# EAGLE design GoL 1.3 (EAGLE 7.2.0)
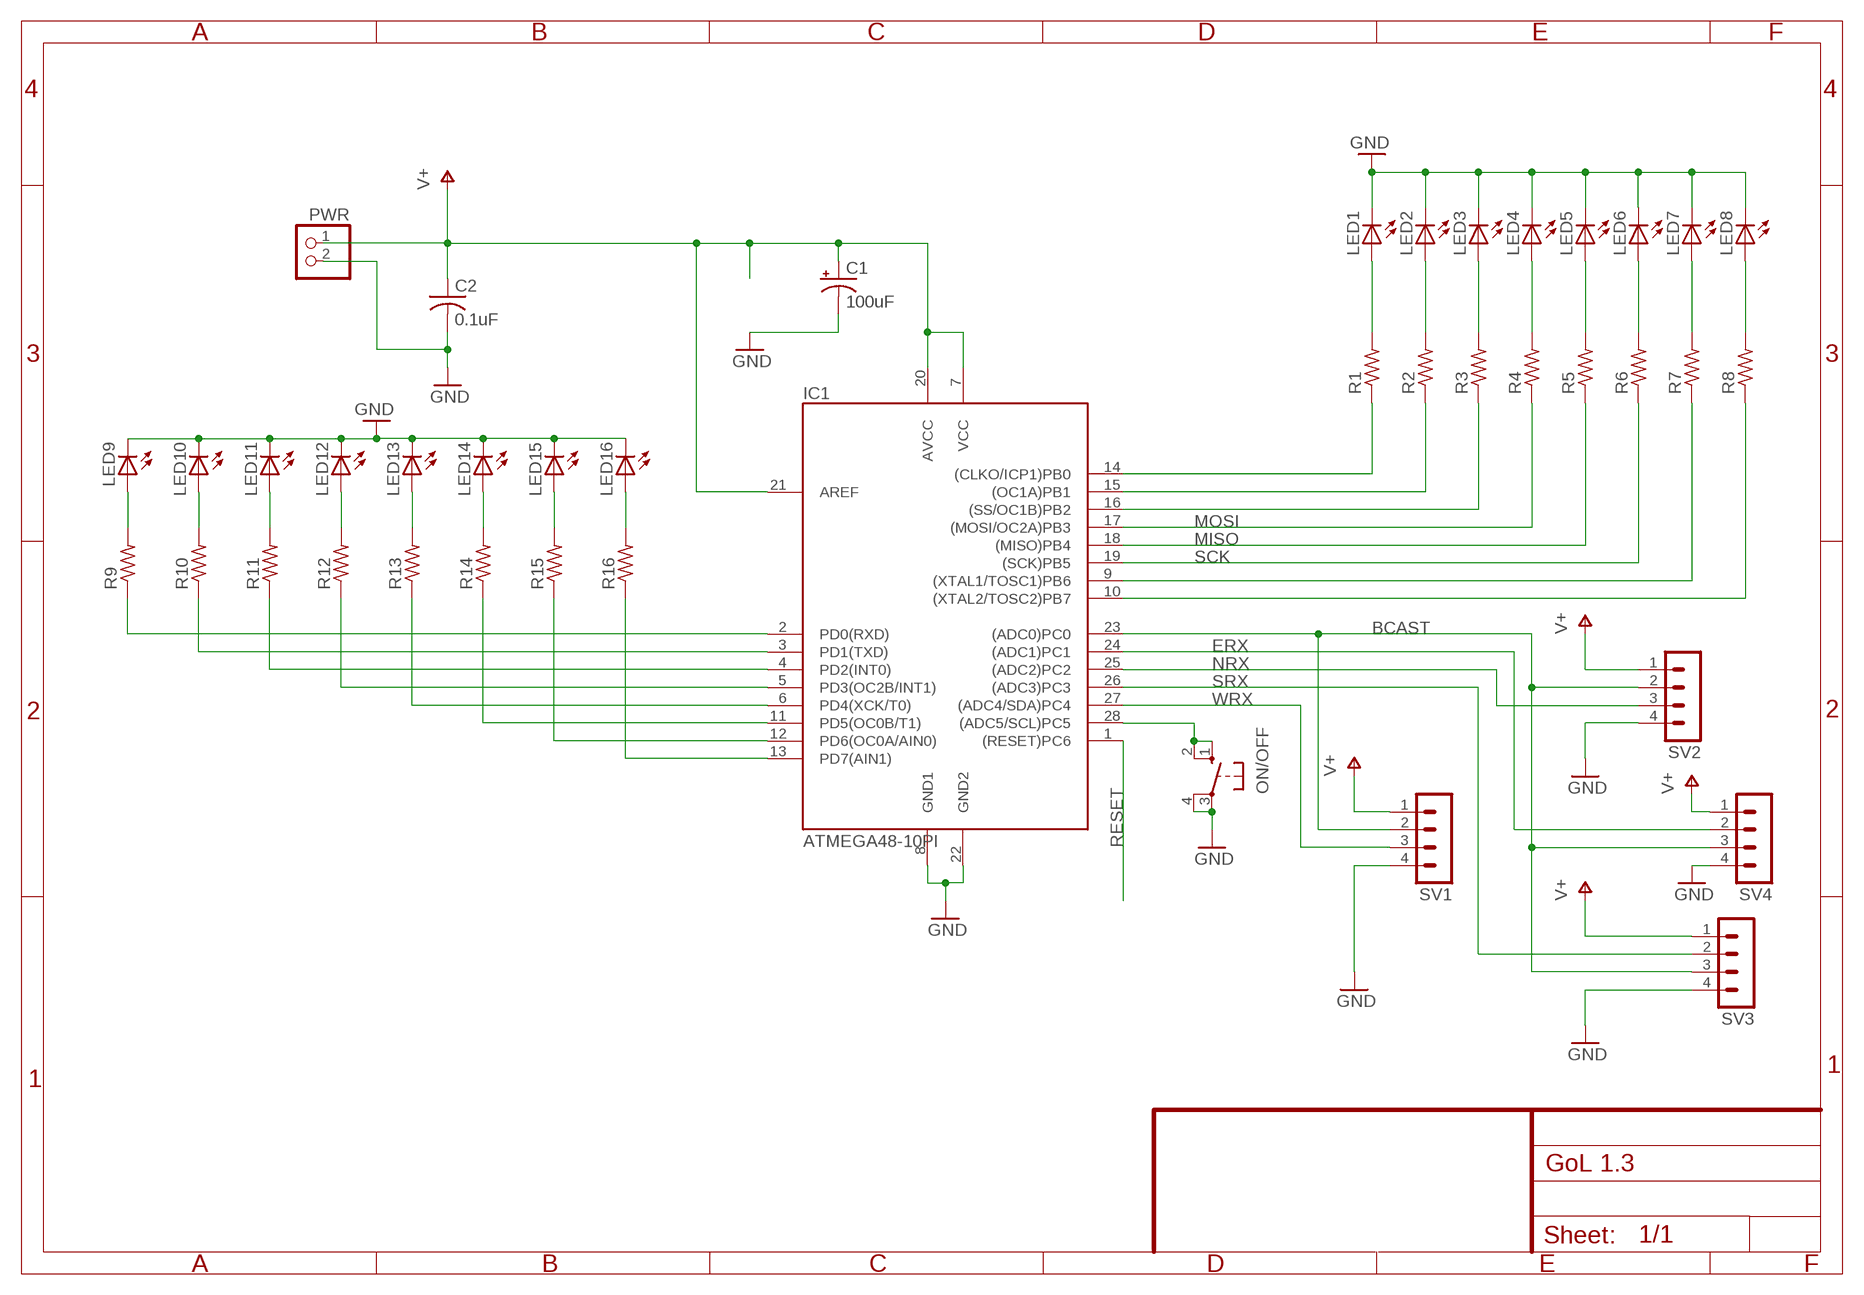
[diagram p0: schematic, sheet 1]

## Parts
C1  100uF  CPOL-USE2.5-6  [E2,5-6]
C2  0.1uF  C-US025-025X050  [C025-025X050]
IC1  ATMEGA48-10PI  [DIL28-3]
LED1  LED5MMEZ  [LED5MM-EZ]
LED2  LED5MMEZ  [LED5MM-EZ]
LED3  LED5MMEZ  [LED5MM-EZ]
LED4  LED5MMEZ  [LED5MM-EZ]
LED5  LED5MMEZ  [LED5MM-EZ]
LED6  LED5MMEZ  [LED5MM-EZ]
LED7  LED5MMEZ  [LED5MM-EZ]
LED8  LED5MMEZ  [LED5MM-EZ]
LED9  LED5MMEZ  [LED5MM-EZ]
LED10  LED5MMEZ  [LED5MM-EZ]
LED11  LED5MMEZ  [LED5MM-EZ]
LED12  LED5MMEZ  [LED5MM-EZ]
LED13  LED5MMEZ  [LED5MM-EZ]
LED14  LED5MMEZ  [LED5MM-EZ]
LED15  LED5MMEZ  [LED5MM-EZ]
LED16  LED5MMEZ  [LED5MM-EZ]
ON/OFF  10-XX  [B3F-10XX]
PWR  PINHD-1X2  [1X02]
R1  R-US_0207/10  [0207/10]
R2  R-US_0207/10  [0207/10]
R3  R-US_0207/10  [0207/10]
R4  R-US_0207/10  [0207/10]
R5  R-US_0207/10  [0207/10]
R6  R-US_0207/10  [0207/10]
R7  R-US_0207/10  [0207/10]
R8  R-US_0207/10  [0207/10]
R9  R-US_0207/10  [0207/10]
R10  R-US_0207/10  [0207/10]
R11  R-US_0207/10  [0207/10]
R12  R-US_0207/10  [0207/10]
R13  R-US_0207/10  [0207/10]
R14  R-US_0207/10  [0207/10]
R15  R-US_0207/10  [0207/10]
R16  R-US_0207/10  [0207/10]
SV1  MA04-1  [MA04-1]
SV2  MA04-1  [MA04-1]
SV3  MA04-1  [MA04-1]
SV4  MA04-1  [MA04-1]

## Nets
BCAST: IC1.23((ADC0)PC0) SV1.2 SV2.2 SV3.3 SV4.3
ERX: IC1.24((ADC1)PC1) SV4.2
GND: C1.- C2.2 IC1.8(GND1) IC1.22(GND2) LED1.K(C) LED2.K(C) LED3.K(C) LED4.K(C) LED5.K(C) LED6.K(C) LED7.K(C) LED8.K(C) LED9.K(C) LED10.K(C) LED11.K(C) LED12.K(C) LED13.K(C) LED14.K(C) LED15.K(C) LED16.K(C) ON/OFF.3(P) ON/OFF.4(P1) PWR.2 SV1.4 SV2.4 SV3.4 SV4.4
MISO: IC1.18((MISO)PB4) R5.1
MOSI: IC1.17((MOSI/OC2A)PB3) R4.1
N$1: LED1.A R1.2
N$2: LED2.A R2.2
N$3: LED3.A R3.2
N$4: LED4.A R4.2
N$5: LED5.A R5.2
N$6: LED6.A R6.2
N$7: LED7.A R7.2
N$8: LED8.A R8.2
N$9: LED9.A R9.2
N$10: LED10.A R10.2
N$11: LED11.A R11.2
N$12: LED12.A R12.2
N$13: LED13.A R13.2
N$14: LED14.A R14.2
N$15: LED15.A R15.2
N$16: LED16.A R16.2
N$17: IC1.13(PD7(AIN1)) R16.1
N$18: IC1.12(PD6(OC0A/AIN0)) R15.1
N$19: IC1.11(PD5(OC0B/T1)) R14.1
N$20: IC1.6(PD4(XCK/T0)) R13.1
N$21: IC1.5(PD3(OC2B/INT1)) R12.1
N$22: IC1.4(PD2(INT0)) R11.1
N$23: IC1.3(PD1(TXD)) R10.1
N$24: IC1.2(PD0(RXD)) R9.1
N$25: IC1.28((ADC5/SCL)PC5) ON/OFF.1(S) ON/OFF.2(S1)
N$26: IC1.14((CLKO/ICP1)PB0) R1.1
N$27: IC1.15((OC1A)PB1) R2.1
N$28: IC1.16((SS/OC1B)PB2) R3.1
N$32: IC1.9((XTAL1/TOSC1)PB6) R7.1
N$33: IC1.10((XTAL2/TOSC2)PB7) R8.1
NRX: IC1.25((ADC2)PC2) SV2.3
RESET: IC1.1((RESET)PC6)
SCK: IC1.19((SCK)PB5) R6.1
SRX: IC1.26((ADC3)PC3) SV3.2
V+: C1.+ C2.1 IC1.7(VCC) IC1.20(AVCC) IC1.21(AREF) PWR.1 SV1.1 SV2.1 SV3.1 SV4.1
WRX: IC1.27((ADC4/SDA)PC4) SV1.3

## Library data of the parts
C1 = rcl-ez:CPOL-US: POLARIZED CAPACITOR, American symbol
C2 = rcl-ez:C-US: CAPACITOR, American symbol
IC1 = atmel-2005:ATMEGA*PI: MICROCONTROLLER 8KB Flash 10-bit ADC Six PWM Channels
LED1-LED16 = led:LED: LED OSRAM: - CHIPLED LG R971, LG N971, LY N971, LG Q971, LY Q971, LO R971, LY R971 LH N974, LH R974 LS Q976, LO Q976, LY Q976 LO Q996 - Hyper CHIPLED LW Q18S LB Q993, LB Q99A, LB R99A - SideLED LS A670, LO A670, LY A670, LG A670, LP A670 LB A673, LV A673, LT A673, LW A673 LH A674 LY A675 LS A676, LA A676, LO A676, LY A676, LW A676 LS A679, LY A679, LG A679 - Hyper Micro SIDELED® LS Y876, LA Y876, LO Y876, LY Y876 LT Y87S - SmartLED LW L88C, LW L88S LB L89C, LB L89S, LG L890 LS L89K, LO L89K, LY L89K LS L896, LA L896, LO L896, LY L896 - TOPLED LS T670, LO T670, LY T670, LG T670, LP T670 LSG T670, LSP T670, LSY T670, LOP T670, LYG T670 LG T671, LOG T671, LSG T671 LB T673, LV T673, LT T673, LW T673 LH T674 LS T676, LA T676, LO T676, LY T676, LB T676, LH T676, LSB T676, LW T676 LB T67C, LV T67C, LT T67C, LS T67K, LO T67K, LY T67K, LW E67C LS E67B, LA E67B, LO E67B, LY E67B, LB E67C, LV E67C, LT E67C LW T67C LS T679, LY T679, LG T679 LS T770, LO T770, LY T770, LG T770, LP T770 LB T773, LV T773, LT T773, LW T773 LH T774 LS E675, LA E675, LY E675, LS T675 LS T776, LA T776, LO T776, LY T776, LB T776 LHGB T686 LT T68C, LB T68C - Hyper Mini TOPLED® LB M676 - Mini TOPLED Santana® LG M470 LS M47K, LO M47K, LY M47K Source: http://www.osram.convergy.de/
ON/OFF = switch-omron:10-XX: OMRON SWITCH
PWR = pinhead:PINHD-1X2: PIN HEADER
R1-R16 = rcl-ez:R-US_: RESISTOR, American symbol
SV1-SV4 = con-lstb:MA04-1: PIN HEADER; OC_FARNELL: unknown; OC_NEWARK: unknown

## Net classes
1 power: width 1.27 mm, drill 0.711 mm, clearance 0.406 mm

## Board
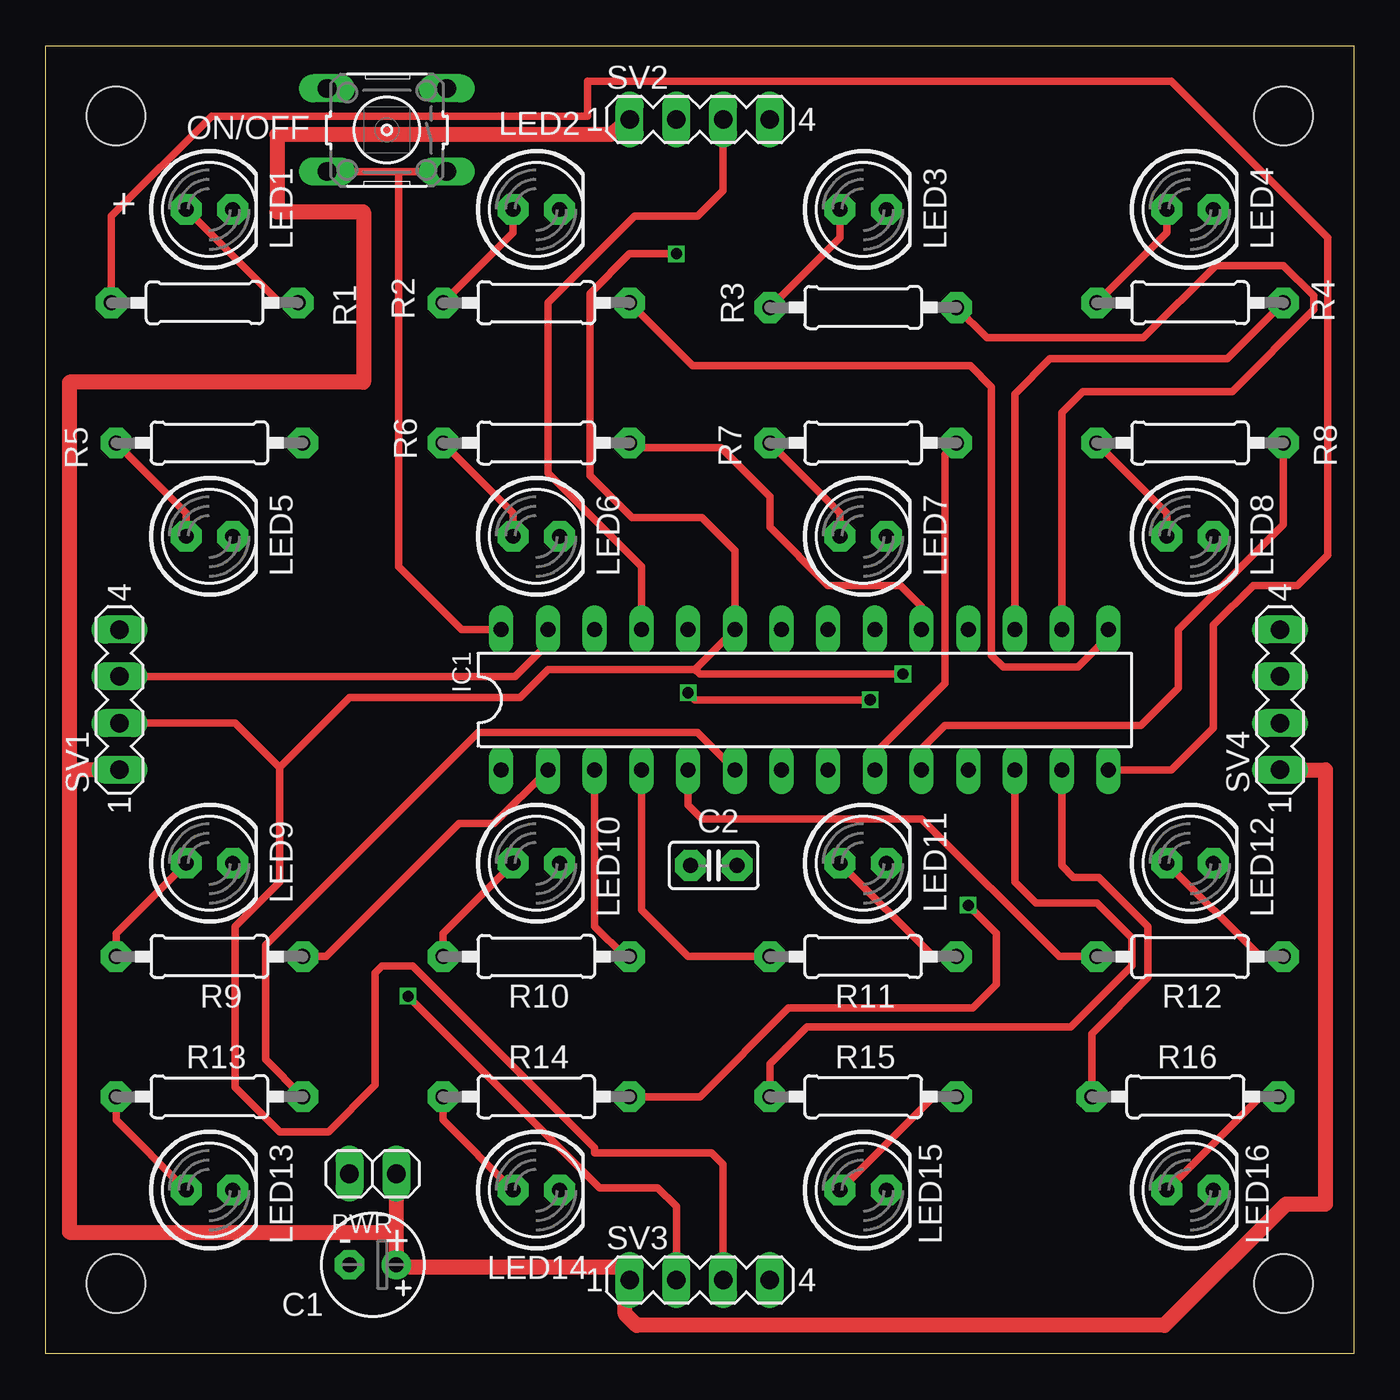
[diagram p1: board, top side]
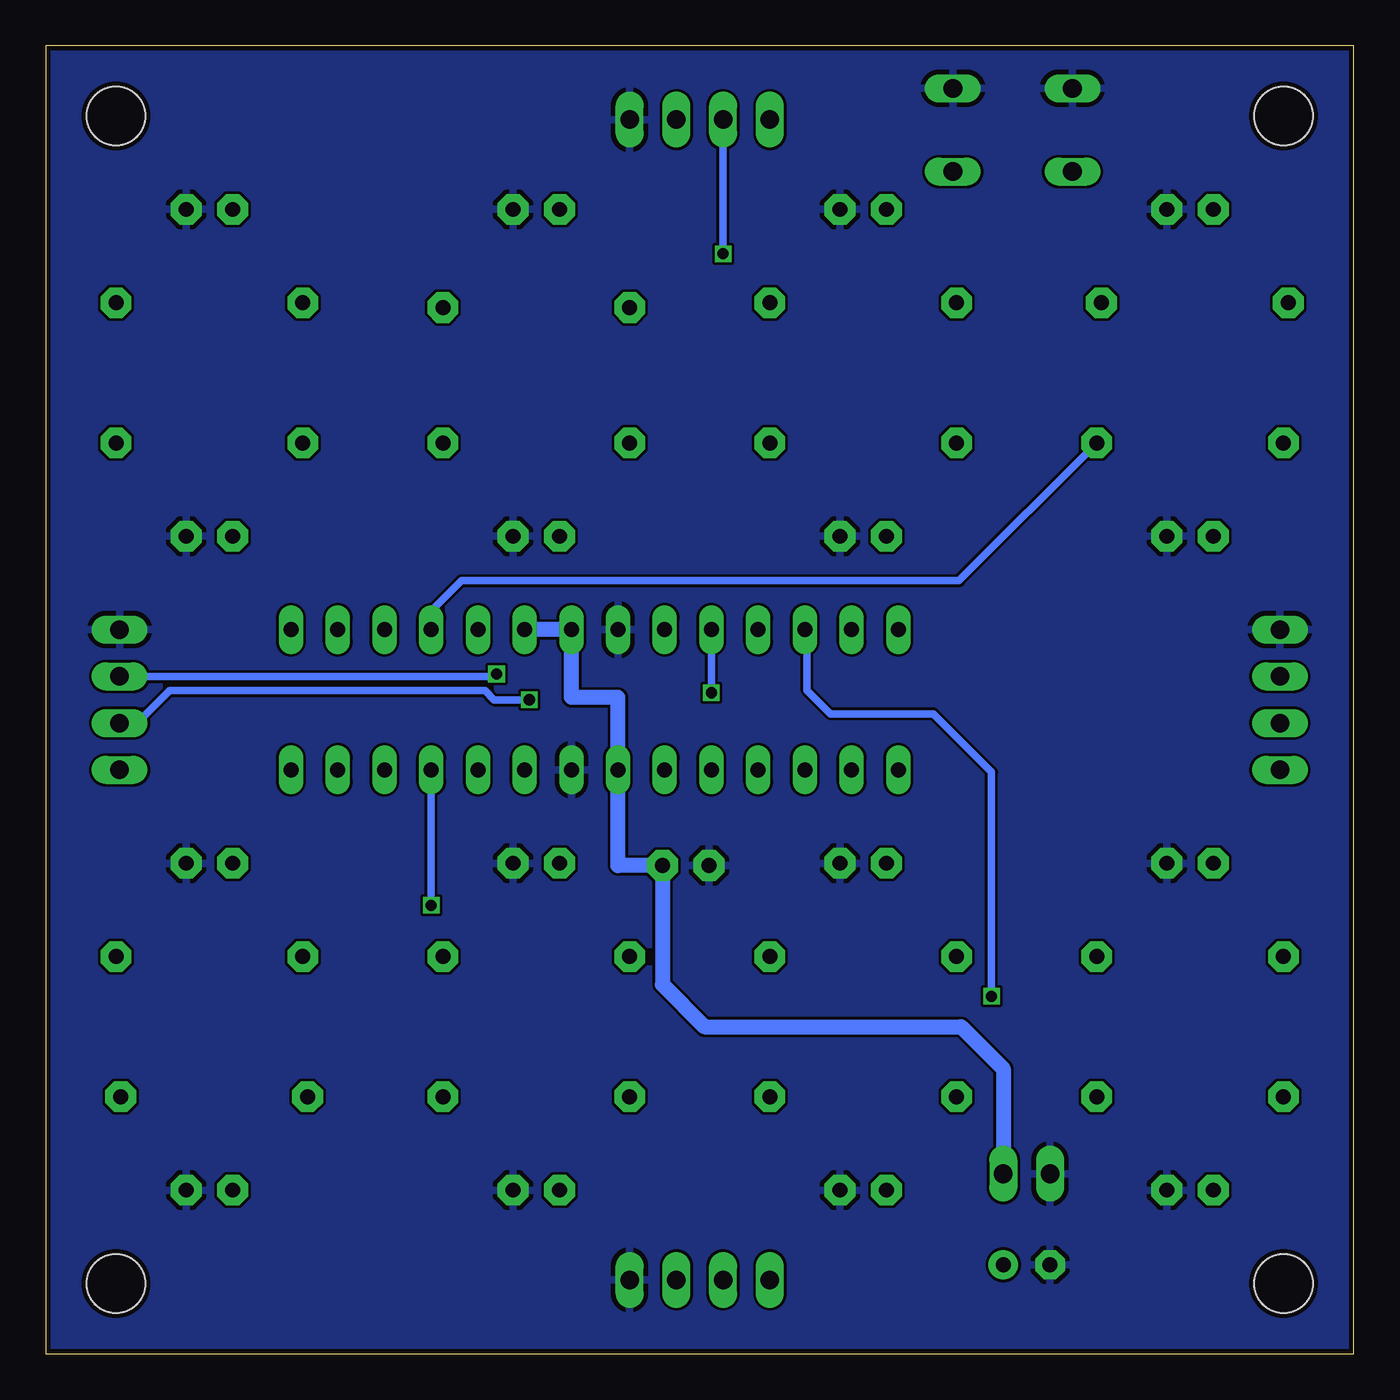
[diagram p2: board, bottom side, seen from below]

Size 71.12 x 71.12 mm. Coordinates in mm from the lower left corner, seen from the top.
Outline: 0,0 0,71.12 71.12,71.12 71.12,0 0,0
Copper layers (1*16): Top 0.035mm / dielectric 1.5mm / Bottom 0.035mm
Design rules "SeeedStudio_2layer_DRU_no_angle_20140221": minimum track width 6mil, minimum drill 12mil, track to track 6mil, track to pad 6mil, pad to pad 6mil, via to via 6mil, smd to smd 0mil, copper to edge 10mil, drill to drill 10mil, minimum pad ring 10mil, minimum via ring 6mil, stop-mask expansion 2mil, vias tented up to drill 100mil, thermal gap 10mil
Holes 3.2 mm at 3.81,67.31 67.31,67.31 67.31,3.81 3.81,3.81

### Footprints (pad centres in the part's own frame; a part is rotated, then mirrored left to right if it is on the bottom)
E2,5-6 = drill 0.813 pad 1.6: + -1.27,0 | drill 0.813 pad 1.6 octagon: - 1.27,0
C025-025X050 = drill 0.813 pad 1.676 octagon: 1 -1.27,0; 2 1.27,0
DIL28-3 = drill 0.813 long: 1 -16.51,-3.81; 2 -13.97,-3.81; 3 -11.43,-3.81; 4 -8.89,-3.81; 5 -6.35,-3.81; 6 -3.81,-3.81; 7 -1.27,-3.81; 8 1.27,-3.81; 9 3.81,-3.81; 10 6.35,-3.81; 11 8.89,-3.81; 12 11.43,-3.81; 13 13.97,-3.81; 14 16.51,-3.81; 15 16.51,3.81; 16 13.97,3.81; 17 11.43,3.81; 18 8.89,3.81; 19 6.35,3.81; 20 3.81,3.81; 21 1.27,3.81; 22 -1.27,3.81; 23 -3.81,3.81; 24 -6.35,3.81; 25 -8.89,3.81; 26 -11.43,3.81; 27 -13.97,3.81; 28 -16.51,3.81
LED5MM-EZ = drill 0.813 pad 1.676 octagon: A -1.27,0; K 1.27,0
B3F-10XX = drill 1.016 long: 1 -3.251,2.261; 2 3.251,2.261; 3 -3.251,-2.261; 4 3.251,-2.261
1X02 = drill 1.016 long: 1 -1.27,0; 2 1.27,0
0207/10 = drill 0.813 pad 1.676 octagon: 1 -5.08,0; 2 5.08,0
MA04-1 = drill 1.016 long: 1 -3.81,0; 2 -1.27,0; 3 1.27,0; 4 3.81,0

### Placement (x,y rotation side)
C1  17.78,4.83 180 top
C2  36.32,26.54 180 top
IC1  41.27,35.56 0 top
LED1  8.89,62.23 0 top
LED2  26.67,62.23 0 top
LED3  44.45,62.23 0 top
LED4  62.23,62.23 0 top
LED5  8.89,44.45 0 top
LED6  26.67,44.45 0 top
LED7  44.45,44.45 0 top
LED8  62.23,44.45 0 top
LED9  8.89,26.67 0 top
LED10  26.67,26.67 0 top
LED11  44.45,26.67 0 top
LED12  62.23,26.67 0 top
LED13  8.89,8.89 0 top
LED14  26.67,8.89 0 top
LED15  44.45,8.89 0 top
LED16  62.23,8.89 0 top
ON/OFF  18.54,66.55 180 top
PWR  17.78,9.78 180 top
R1  8.64,57.15 0 top
R2  26.67,57.15 180 top
R3  44.45,56.9 180 top
R4  62.23,57.15 180 top
R5  8.89,49.53 180 top
R6  26.67,49.53 180 top
R7  44.45,49.53 180 top
R8  62.23,49.53 180 top
R9  8.89,21.59 180 top
R10  26.67,21.59 180 top
R11  44.45,21.59 0 top
R12  62.23,21.59 0 top
R13  8.89,13.97 180 top
R14  26.67,13.97 180 top
R15  44.45,13.97 0 top
R16  61.98,13.97 0 top
SV1  4,35.56 90 top
SV2  35.56,67.12 0 top
SV3  35.56,4 0 top
SV4  67.12,35.56 90 top

### Tracks (layer width: path | path; a pad name or v marks a point on that pad's centre or on a via)
BCAST  (via drill 0.6)
  Top 0.406: 35.31,37.21 27.3,37.21 25.78,35.69 16.51,35.69 12.7,31.88 | 35.31,37.21 IC1.23 37.47,43.69 35.69,45.47 31.88,45.47 29.59,47.75 29.59,57.66 31.75,59.82 v34.29,59.82 | v46.61,36.96 35.56,36.96 35.31,37.21 | SV3.3 36.83,10.29 36.2,10.92 29.84,10.92 29.84,11.18 19.94,21.08 18.29,21.08 17.91,20.7 17.91,14.61 15.37,12.06 12.7,12.06 10.29,14.48 10.29,23.24 12.7,25.65 12.7,31.88 | SV1.2 10.29,34.29 12.7,31.88
  Bottom 0.406: SV4.3 46.74,36.83 v46.61,36.96 | v34.29,59.82 SV2.2
ERX  (via drill 0.6)
  Top 0.406: v44.83,35.56 35.31,35.56 v34.92,35.94
  Bottom 0.406: SV4.2 66.17,34.29 64.39,36.07 47.24,36.07 46.74,35.56 v44.83,35.56 | v34.92,35.94 IC1.24
GND
  pour Bottom: 0,0 0,71.12 71.12,71.12 71.12,0
MISO
  Bottom 0.406: IC1.18 50.16,40.39 48.51,42.04 21.46,42.04 R5.1
MOSI
  Top 0.406: IC1.17 52.7,52.2 54.61,54.1 64.26,54.1 R4.1
N$1
  Top 0.406: R1.2 12.7,57.15 LED1.A
N$2
  Top 0.406: LED2.A 25.4,60.96 R2.2
N$3
  Top 0.406: LED3.A 43.18,60.71 R3.2
N$4
  Top 0.406: LED4.A 60.96,60.96 R4.2
N$5
  Top 0.406: LED5.A 7.62,45.72 R5.2
N$6
  Top 0.406: LED6.A 25.4,45.72 R6.2
N$7
  Top 0.406: LED7.A 43.18,45.72 R7.2
N$8
  Top 0.406: LED8.A 60.96,45.72 R8.2
N$9
  Top 0.406: R9.2 3.81,22.86 LED9.A
N$10
  Top 0.406: R10.2 21.59,22.86 LED10.A
N$11
  Top 0.406: R11.2 48.26,21.59 LED11.A
N$12
  Top 0.406: R12.2 66.04,21.59 LED12.A
N$13
  Top 0.406: R13.2 3.81,12.7 LED13.A
N$14
  Top 0.406: R14.2 21.59,12.7 LED14.A
N$15
  Top 0.406: R15.2 48.26,13.97 LED15.A
N$16
  Top 0.406: R16.2 66.04,13.97 LED16.A
N$17
  Top 0.406: R16.1 56.9,17.4 59.94,20.45 59.94,23.24 57.28,25.91 55.88,25.91 55.24,26.54 IC1.13
N$18
  Top 0.406: R15.1 39.37,15.75 41.4,17.78 55.75,17.78 59.05,21.08 59.05,22.61 57.15,24.51 53.85,24.51 52.7,25.65 IC1.12
N$19  (via drill 0.6)
  Top 0.406: R14.1 35.56,13.97 40.39,18.8 50.42,18.8 51.69,20.07 51.69,22.86 v50.16,24.38
  Bottom 0.406: v50.16,24.38 IC1.11
N$20
  Top 0.406: R13.1 11.94,16 11.94,22.23 23.5,33.78 35.43,33.78 IC1.6
N$21
  Top 0.406: R12.1 55.12,21.59 47.62,29.08 35.69,29.08 34.92,29.84 IC1.5
N$22
  Top 0.406: R11.1 34.92,21.59 32.38,24.13 IC1.4
N$23
  Top 0.406: R10.1 31.5,21.59 29.84,23.24 IC1.3
N$24
  Top 0.406: R9.1 15.24,21.59 22.48,28.83 24.38,28.83 IC1.2
N$25
  Top 0.406: ON/OFF.1 19.18,64.29 | 19.18,64.29 ON/OFF.2 | IC1.28 22.61,39.37 19.18,42.8 19.18,64.29
N$26
  Top 0.406: R1.1 3.56,61.85 9.02,67.31 29.46,67.31 29.46,69.22 61.21,69.22 69.72,60.71 69.72,43.43 68.07,41.78 65.66,41.78 63.5,39.62 63.5,34.04 61.21,31.75 IC1.14
N$27
  Top 0.406: IC1.15 57.78,38.99 56.13,37.34 52.07,37.34 51.44,37.97 51.44,52.58 50.29,53.72 35.18,53.72 R2.1
N$28
  Top 0.406: IC1.16 55.24,51.18 56.39,52.32 64.52,52.32 68.96,56.77 68.96,57.53 67.31,59.18 63.63,59.18 59.69,55.24 51.18,55.24 R3.1
N$32
  Top 0.406: IC1.9 45.09,32.64 48.9,36.45 48.9,48.9 R7.1
N$33
  Top 0.406: R8.1 67.31,45.09 61.59,39.37 61.59,36.2 59.56,34.16 48.9,34.16 47.62,32.89 IC1.10
NRX
  Top 0.406: IC1.25 32.38,42.8 27.3,47.88 27.3,57.15 32,61.85 35.43,61.85 36.83,63.25 SV2.3
SCK
  Top 0.406: IC1.19 47.62,40.64 46.48,41.78 42.55,41.78 39.37,44.96 39.37,46.61 36.7,49.28 32,49.28 R6.1
SRX  (via drill 0.6)
  Top 0.406: SV3.2 34.29,8 33.27,9.02 30.1,9.02 v19.68,19.43
  Bottom 0.406: v19.68,19.43 19.68,31.62 22.86,34.8 28.45,34.8 29.72,36.07 29.72,39.24 IC1.26
V+
  Top 0.813: SV4.1 69.6,31.75 69.6,8.13 67.44,8.13 60.83,1.52 32.13,1.52 31.5,2.16 31.5,3.75 SV3.1 31.62,4.7 19.18,4.7 C1.+ 19.05,6.6 | SV1.1 1.27,31.75 | 1.27,31.75 1.27,6.6 19.05,6.6 | 1.27,31.75 1.27,52.83 17.27,52.83 17.27,62.1 12.57,62.1 12.57,66.29 30.73,66.29 SV2.1 | PWR.1 19.05,6.6
  Bottom 0.813: IC1.20 IC1.21 42.55,35.69 40.01,35.69 IC1.7 40.01,26.54 C2.1 37.59,20.07 35.31,17.78 21.34,17.78 19.05,15.49 PWR.1
WRX
  Top 0.406: IC1.27 27.3,38.61 25.53,36.83 SV1.3

### Text on the board
tPlace: + | - | +
tDocu: Game of Life | North | West | East | THOR | South